# Altium schematic sheet knobs-and-teensy.SchDoc
size Letter
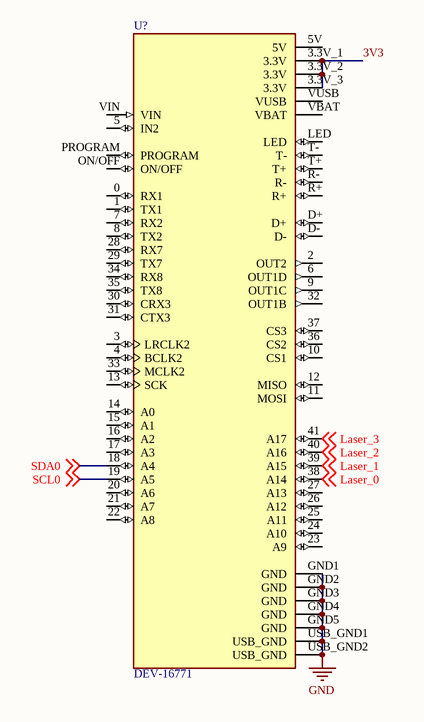
[diagram p0: knobs-and-teensy.SchDoc]

## Parts
U?  DEV-16771  [MODULE_DEV-16771]

## Nets
GND: U?.GND1(GND) U?.GND2(GND) U?.GND3(GND) U?.GND4(GND) U?.GND5(GND) U?.USB_GND1(USB_GND) U?.USB_GND2(USB_GND)
3V3: U?.3.3V_1(3.3V) U?.3.3V_2(3.3V) U?.3.3V_3(3.3V)
Laser_0: U?.38(A14) ; off-sheet Laser_0
Laser_1: U?.39(A15) ; off-sheet Laser_1
Laser_2: U?.40(A16) ; off-sheet Laser_2
Laser_3: U?.41(A17) ; off-sheet Laser_3
SCL0: U?.19(A5) ; off-sheet SCL0
SDA0: U?.18(A4) ; off-sheet SDA0

Not connected (* = marked no-connect by the designer): U? 0(RX1) 1(TX1) 2(OUT2) 3(LRCLK2) 4(BCLK2) 5(IN2) 5V 6(OUT1D) 7(RX2) 8(TX2) 9(OUT1C) 10(CS1) 11(MOSI) 12(MISO) 13(SCK) 14(A0) 15(A1) 16(A2) 17(A3) 20(A6) 21(A7) 22(A8) 23(A9) 24(A10) 25(A11) 26(A12) 27(A13) 28(RX7) 29(TX7) 30(CRX3) 31(CTX3) 32(OUT1B) 33(MCLK2) 34(RX8) 35(TX8) 36(CS2) 37(CS3) D+ D- LED ON/OFF PROGRAM R+ R- T+ T- VBAT VIN VUSB

## Library data of the parts
U? = DEV-16771: RT1062 Teensy 4.1 series ARMÂ® CortexÂ®-M7 MPU Embedded Evaluation Board; MF: SparkFun Electronics; Purchase-URL: https://pricing.snapeda.com/search/part/DEV-16771/?ref=eda; Package: None; Availability: In Stock; SnapEDA_Link: https://www.snapeda.com/parts/DEV-16771/SparkFun+Electronics/view-part/?ref=snap; MP: DEV-16771; Check_prices: https://www.snapeda.com/parts/DEV-16771/SparkFun+Electronics/view-part/?ref=eda; Value: *; Price: None